# EAGLE design PWDTimer_8Lane (EAGLE 9.6.2)
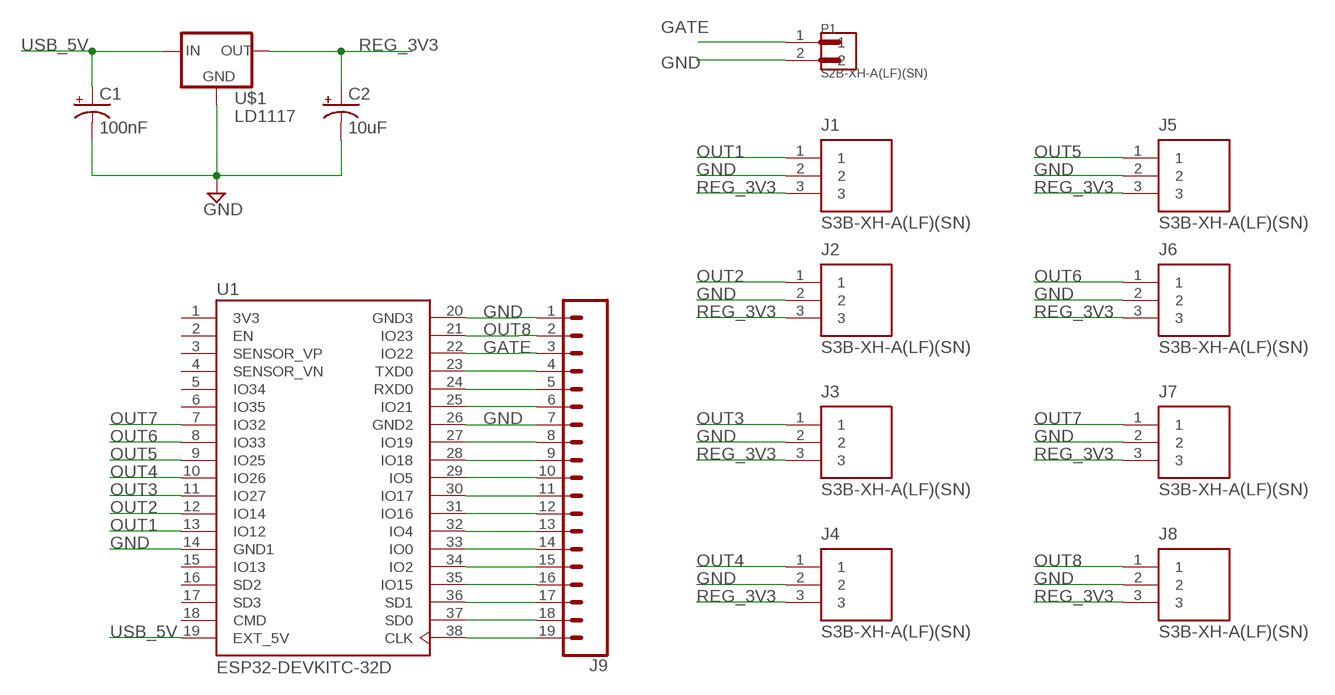
[diagram p0: schematic, sheet 1]

## Parts
C1  100nF  10UF-POLAR-RADIAL-2.5MM-25V-20%  [CPOL-RADIAL-2.5MM-5MM]
C2  10uF  10UF-POLAR-RADIAL-2.5MM-25V-20%  [CPOL-RADIAL-2.5MM-5MM]
J1  S3B-XH-A(LF)(SN)  [JST_S3B-XH-A(LF)(SN)]
J2  S3B-XH-A(LF)(SN)  [JST_S3B-XH-A(LF)(SN)]
J3  S3B-XH-A(LF)(SN)  [JST_S3B-XH-A(LF)(SN)]
J4  S3B-XH-A(LF)(SN)  [JST_S3B-XH-A(LF)(SN)]
J5  S3B-XH-A(LF)(SN)  [JST_S3B-XH-A(LF)(SN)]
J6  S3B-XH-A(LF)(SN)  [JST_S3B-XH-A(LF)(SN)]
J7  S3B-XH-A(LF)(SN)  [JST_S3B-XH-A(LF)(SN)]
J8  S3B-XH-A(LF)(SN)  [JST_S3B-XH-A(LF)(SN)]
J9  CONN_191X19_NO_SILK  [1X19_NO_SILK]
P1  S2B-XH-A(LF)(SN)  [JST_S2B-XH-A(LF)(SN)]
U1  ESP32-DEVKITC-32D  [MODULE_ESP32-DEVKITC-32D]
U$1  LD1117  [TO220]

## Nets
GATE: J9.3 P1.1 U1.22(IO22)
GND: C1.2(-) C2.2(-) J1.2 J2.2 J3.2 J4.2 J5.2 J6.2 J7.2 J8.2 J9.1 J9.7 P1.2 U1.14(GND1) U1.20(GND3) U1.26(GND2) U$1.1(GND)
N$1: J9.4 U1.23(TXD0)
N$2: J9.5 U1.24(RXD0)
N$3: J9.6 U1.25(IO21)
N$4: J9.8 U1.27(IO19)
N$5: J9.9 U1.28(IO18)
N$6: J9.10 U1.29(IO5)
N$7: J9.11 U1.30(IO17)
N$8: J9.12 U1.31(IO16)
N$9: J9.13 U1.32(IO4)
N$10: J9.14 U1.33(IO0)
N$11: J9.15 U1.34(IO2)
N$12: J9.16 U1.35(IO15)
N$13: J9.17 U1.36(SD1)
N$14: J9.18 U1.37(SD0)
N$15: J9.19 U1.38(CLK)
OUT1: J1.1 U1.13(IO12)
OUT2: J2.1 U1.12(IO14)
OUT3: J3.1 U1.11(IO27)
OUT4: J4.1 U1.10(IO26)
OUT5: J5.1 U1.9(IO25)
OUT6: J6.1 U1.8(IO33)
OUT7: J7.1 U1.7(IO32)
OUT8: J8.1 J9.2 U1.21(IO23)
REG_3V3: C2.1(+) J1.3 J2.3 J3.3 J4.3 J5.3 J6.3 J7.3 J8.3 U$1.2(OUT)
USB_5V: C1.1(+) U1.19(EXT_5V) U$1.3(IN)
Unconnected: U1.2(EN) U1.3(SENSOR_VP) U1.4(SENSOR_VN) U1.5(IO34) U1.6(IO35) U1.15(IO13) U1.16(SD2) U1.17(SD3) U1.18(CMD)

## Power pins joined to a net without a drawn wire
3V3: U1.1(3V3)

## Library data of the parts
C1 = SparkFun-Capacitors:10UF-POLAR: 10.0µF polarized capacitors A capacitor is a passive two-terminal electrical component used to store electrical energy temporarily in an electric field.; PROD_ID: CAP-08440; VALUE: 10uF
C2 = SparkFun-Capacitors:10UF-POLAR: 10.0µF polarized capacitors A capacitor is a passive two-terminal electrical component used to store electrical energy temporarily in an electric field.; PROD_ID: CAP-08440
J1-J8 = S3B-XH-A_LF__SN_:S3B-XH-A(LF)(SN): Connector Header Through Hole, Right Angle 3 position 0.098" (2.50mm) Check availability <https://pricing.snapeda.com/parts/S3B-XH-A%28LF%29%28SN%29/JST%20Sales%20America%20Inc./view-part?ref=eda>; AVAILABILITY: In Stock; DESCRIPTION: Connector Header Through Hole, Right Angle 3 position 0.098 (2.50mm); MF: JST Sales America Inc.; MP: S3B-XH-A(LF)(SN); PACKAGE: Custom Package JST Sales; PRICE: None
J9 = SparkFun-Connectors:CONN_19: Multi connection point. Often used as Generic Header-pin footprint for 0.1 inch spaced/style header connections On any of the 0.1 inch spaced packages, you can populate with these: Break Away Headers - Straight <https://www.sparkfun.com/products/116> (PRT-00116) Break Away Male Headers - Right Angle <https://www.sparkfun.com/products/553> (PRT-00553) Female Headers <https://www.sparkfun.com/products/115> (PRT-00115) Break Away Headers - Machine Pin <https://www.sparkfun.com/products/117> (PRT-00117) Break Away Female Headers - Swiss Machine Pin <https://www.sparkfun.com/products/743> (PRT-00743) For SCREWTERMINALS and SPRING TERMINALS visit here: Screw Terimnals on SparkFun.com <https://www.sparkfun.com/search/results?term=Screw+Terminals> (5mm/3.5mm/2.54mm spacing) This device is also useful as a general connection point to wire up your design to another part of your project. Our various solder wires solder well into these plated through hole pads. Hook-Up Wire - Assortment (Stranded, 22 AWG) <https://www.sparkfun.com/products/11375> (PRT-11375) Hook-Up Wire - Assortment (Solid Core, 22 AWG) <https://www.sparkfun.com/products/11367> (PRT-11367) View the entire wire category on our website here <https://www.sparkfun.com/categories/141> Special notes: Molex polarized connector foot print use with SKU : PRT-08231 with associated crimp pins and housings. 1MM SMD Version SKU: PRT-10208 NOTES ON THE VARIANTS LOCK and LOCK_LONGPADS... This footprint was designed to help hold the alignment of a through-hole component (i.e. 6-pin header) while soldering it into place. You may notice that each hole has been shifted either up or down by 0.005 of an inch from it's more standard position (which is a perfectly straight line). This slight alteration caused the pins (the squares in the middle) to touch the edges of the holes. Because they are alternating, it causes a "brace" to hold the component in place. 0.005 has proven to be the perfect amount of "off-center" position when using our standard breakaway headers. Although looks a little odd when you look at the bare footprint, once you have a header in there, the alteration is very hard to notice. Also,if you push a header all the way into place, it is covered up entirely on the bottom side.
P1 = S2B-XH-A_LF__SN_:S2B-XH-A(LF)(SN): XH Series 2.5mm 2 Position Through Hole Shrouded Header Connector Check availability <https://pricing.snapeda.com/parts/S2B-XH-A%28LF%29%28SN%29/JST%20Sales/view-part?ref=eda>; AVAILABILITY: In Stock; DESCRIPTION: Connector Header Through Hole, Right Angle 2 position 0.098 (2.50mm); MF: JST Sales; MP: S2B-XH-A(LF)(SN); PACKAGE: None; PRICE: None; PURCHASE-URL: https://pricing.snapeda.com/search/part/S2B-XH-A(LF)(SN)/?ref=eda
U1 = ESP32-DEVKITC-32D:ESP32-DEVKITC-32D: Eval Board For Esp-Wroom-32 Check availability <https://pricing.snapeda.com/parts/ESP32-DEVKITC-32D/Espressif%20Systems/view-part?ref=eda>; AVAILABILITY: In Stock; DESCRIPTION: WiFi Development Tools (802.11) ESP32 General Development Kit, ESP32-WROOM-32D on the board; MF: Espressif Systems; MP: ESP32-DEVKITC-32D; PACKAGE: None; PRICE: None; PURCHASE-URL: https://pricing.snapeda.com/search/part/ESP32-DEVKITC-32D/?ref=eda
U$1 = LD1117:LD1117: Check availability <https://pricing.snapeda.com/parts/LD1117/STMicroelectronics/view-part?ref=eda>; AVAILABILITY: In Stock; DESCRIPTION: Linear Voltage Regulator IC Positive Fixed 1 Output 800mA DPAK; MF: STMicroelectronics; MP: LD1117; PACKAGE: None; PRICE: None; PURCHASE-URL: https://pricing.snapeda.com/search/part/LD1117/?ref=eda

## Net classes
0 default: width 0.254 mm

## Board
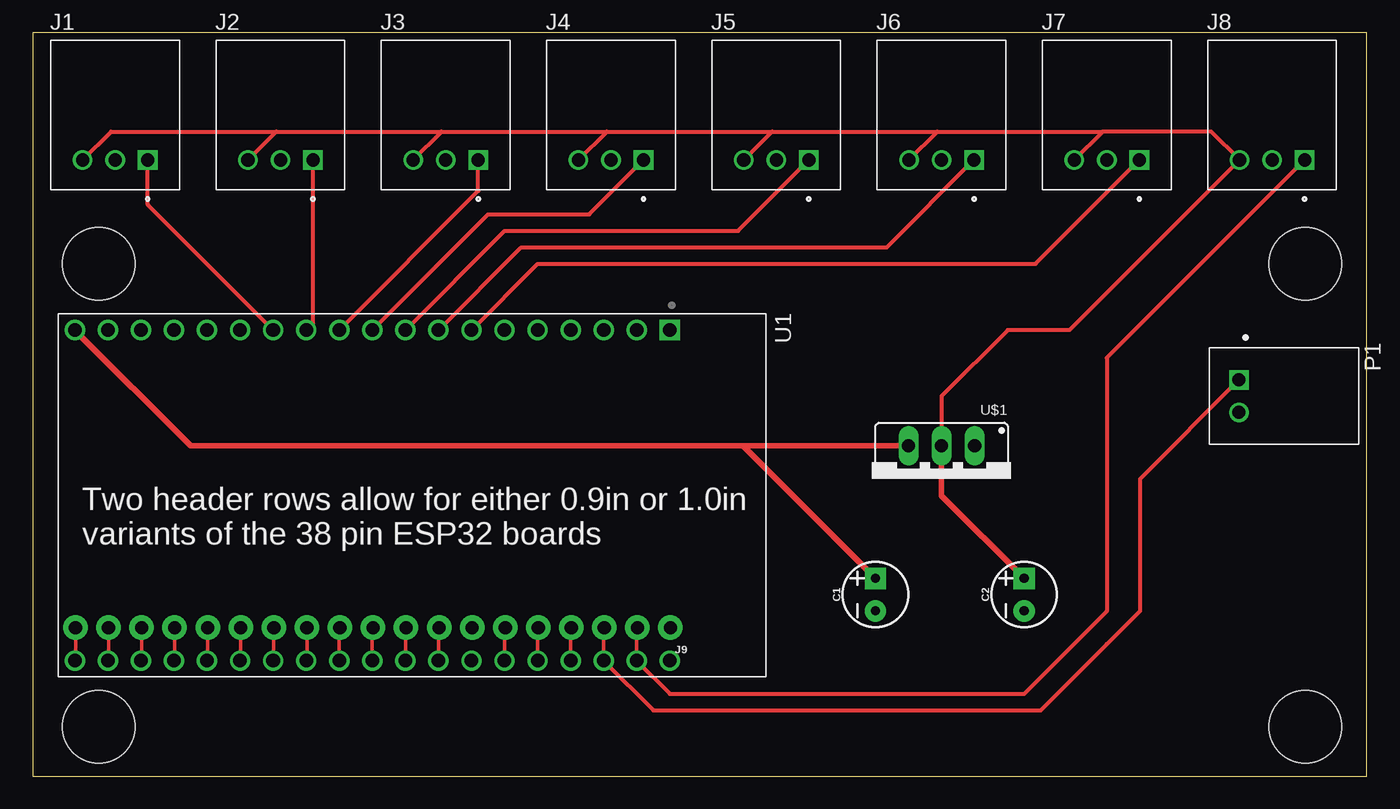
[diagram p1: board, top side]
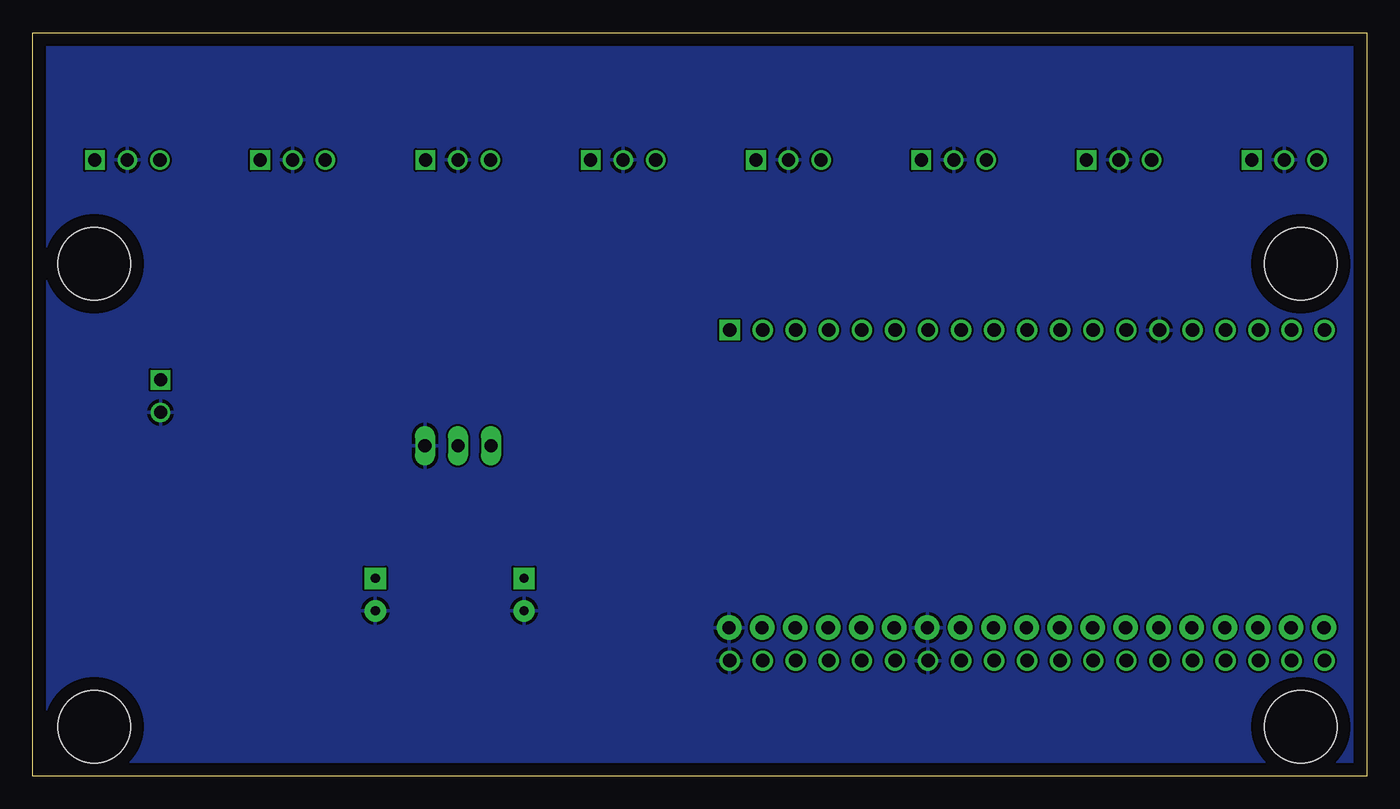
[diagram p2: board, bottom side, seen from below]

Size 102.54 x 57.14 mm. Coordinates in mm from the lower left corner, seen from the top.
Outline: 0,0 102.54,0 102.54,57.14 0,57.14 0,0
Copper layers (1*16): Top 0.035mm / dielectric 1.5mm / Bottom 0.035mm
Design rules "default": minimum track width 6mil, minimum drill 0.35mm, track to track 6mil, track to pad 6mil, pad to pad 6mil, via to via 6mil, smd to smd 6mil, copper to edge 40mil, drill to drill 6mil, minimum pad ring 10mil, minimum via ring 8mil, stop-mask expansion 4mil, vias tented up to drill 0mil, thermal gap 10mil
Holes 5.59 mm at 97.79,3.81 5.08,39.37 5.08,3.81 97.79,39.37

### Footprints (pad centres in the part's own frame; a part is rotated, then mirrored left to right if it is on the bottom)
CPOL-RADIAL-2.5MM-5MM = drill 0.7 pad 1.651 square: 1 1.25,0 | drill 0.7 pad 1.651: 2 -1.25,0
JST_S3B-XH-A(LF)(SN) = drill 1 square: 1 2.5,-3.45 | drill 1: 2 0,-3.45; 3 -2.5,-3.45
1X19_NO_SILK = drill 1.016 pad 1.88: 1 0,0; 2 2.54,0; 3 5.08,0; 4 7.62,0; 5 10.16,0; 6 12.7,0; 7 15.24,0; 8 17.78,0; 9 20.32,0; 10 22.86,0; 11 25.4,0; 12 27.94,0; 13 30.48,0; 14 33.02,0; 15 35.56,0; 16 38.1,0; 17 40.64,0; 18 43.18,0; 19 45.72,0
JST_S2B-XH-A(LF)(SN) = drill 1 square: 1 -1.25,0 | drill 1: 2 1.25,0
MODULE_ESP32-DEVKITC-32D = drill 1.04 square: 1 -12.7,19.76 | drill 1.04: 2 -12.7,17.22; 3 -12.7,14.68; 4 -12.7,12.14; 5 -12.7,9.6; 6 -12.7,7.06; 7 -12.7,4.52; 8 -12.7,1.98; 9 -12.7,-0.56; 10 -12.7,-3.1; 11 -12.7,-5.64; 12 -12.7,-8.18; 13 -12.7,-10.72; 14 -12.7,-13.26; 15 -12.7,-15.8; 16 -12.7,-18.34; 17 -12.7,-20.88; 18 -12.7,-23.42; 19 -12.7,-25.96; 20 12.7,19.76; 21 12.7,17.22; 22 12.7,14.68; 23 12.7,12.14; 24 12.7,9.6; 25 12.7,7.06; 26 12.7,4.52; 27 12.7,1.98; 28 12.7,-0.56; 29 12.7,-3.1; 30 12.7,-5.64; 31 12.7,-8.18; 32 12.7,-10.72; 33 12.7,-13.26; 34 12.7,-15.8; 35 12.7,-18.34; 36 12.7,-20.88; 37 12.7,-23.42; 38 12.7,-25.96
TO220 = drill 1.016 long: 1 -2.54,0; 2 0,0; 3 2.54,0

### Placement (x,y rotation side)
C1  64.77,13.97 90 top
C2  76.2,13.97 90 top
J1  6.35,50.8 0 top
J2  19.05,50.8 0 top
J3  31.75,50.8 0 top
J4  44.45,50.8 0 top
J5  57.15,50.8 0 top
J6  69.85,50.8 0 top
J7  82.55,50.8 0 top
J8  95.25,50.8 0 top
J9  49.02,11.43 180 top
P1  92.71,29.21 270 top
U1  29.21,21.59 270 top
U$1  69.85,25.4 180 top

### Tracks (layer width: path | path; a pad name or v marks a point on that pad's centre or on a via)
GATE
  Top 0.254: U1.22 43.89,11.38 J9.3
  Top 0.305: U1.22 47.7,5.08 52.07,5.08 77.47,5.08 82.55,10.16 85.09,12.7 85.09,22.84 P1.1
GND
  pour Bottom: 0,0 102.87,0 102.87,57.15 0,57.15
N$1
  Top 0.254: U1.23 41.35,11.38 J9.4
N$2
  Top 0.254: U1.24 38.81,11.38 J9.5
N$3
  Top 0.254: U1.25 36.27,11.38 J9.6
N$4
  Top 0.254: U1.27 31.19,11.38 J9.8
N$5
  Top 0.254: U1.28 28.65,11.38 J9.9
N$6
  Top 0.254: U1.29 26.11,11.38 J9.10
N$7
  Top 0.254: U1.30 23.57,11.38 J9.11
N$8
  Top 0.254: J9.12 21.08,8.94 U1.31
N$9
  Top 0.254: J9.13 18.54,8.94 U1.32
N$10
  Top 0.254: J9.14 16,8.94 U1.33
N$11
  Top 0.254: J9.15 13.46,8.94 U1.34
N$12
  Top 0.254: J9.16 10.92,8.94 U1.35
N$13
  Top 0.254: J9.17 8.38,8.94 U1.36
N$14
  Top 0.254: J9.18 5.84,8.94 U1.37
N$15
  Top 0.254: J9.19 3.3,8.94 U1.38
OUT1
  Top 0.305: U1.13 8.85,43.93 J1.1
OUT2
  Top 0.305: U1.12 21.55,34.81 J2.1
OUT3
  Top 0.305: U1.11 34.25,44.97 J3.1
OUT4
  Top 0.305: U1.10 35,43.18 42.78,43.18 J4.1
OUT5
  Top 0.305: U1.9 36.27,41.91 54.21,41.91 J5.1
OUT6
  Top 0.305: U1.8 37.54,40.64 65.64,40.64 J6.1
OUT7
  Top 0.305: U1.7 38.81,39.37 77.07,39.37 J7.1
OUT8
  Top 0.254: U1.21 46.43,11.38 J9.2
  Top 0.305: U1.21 48.97,6.35 76.2,6.35 82.55,12.7 82.55,32.15 J8.1
REG_3V3
  Top 0.305: 18.73,49.53 6.03,49.53 J1.3 | 18.73,49.53 31.43,49.53 | 31.43,49.53 44.13,49.53 | 44.13,49.53 56.83,49.53 | 56.83,49.53 69.53,49.53 | 69.53,49.53 82.23,49.53 | J2.3 18.73,49.53 | J3.3 31.43,49.53 | J4.3 44.13,49.53 | J5.3 56.83,49.53 | J6.3 69.53,49.53 | J7.3 82.23,49.53 | U$1.2 69.85,29.21 74.93,34.29 79.69,34.29 J8.3 90.57,49.53 82.23,49.53
  Top 0.406: C2.1 69.85,21.57 U$1.2
USB_5V
  Top 0.406: U$1.3 54.59,25.4 | U1.19 12.14,25.4 53.34,25.4 54.59,25.4 | C1.1 54.59,25.4

### Text on the board
tPlace: Two header rows allow for either 0.9in or 1.0in / variants of the 38 pin ESP32 boards